# EAGLE design DQ542MA Plasma (EAGLE 9.0.0)
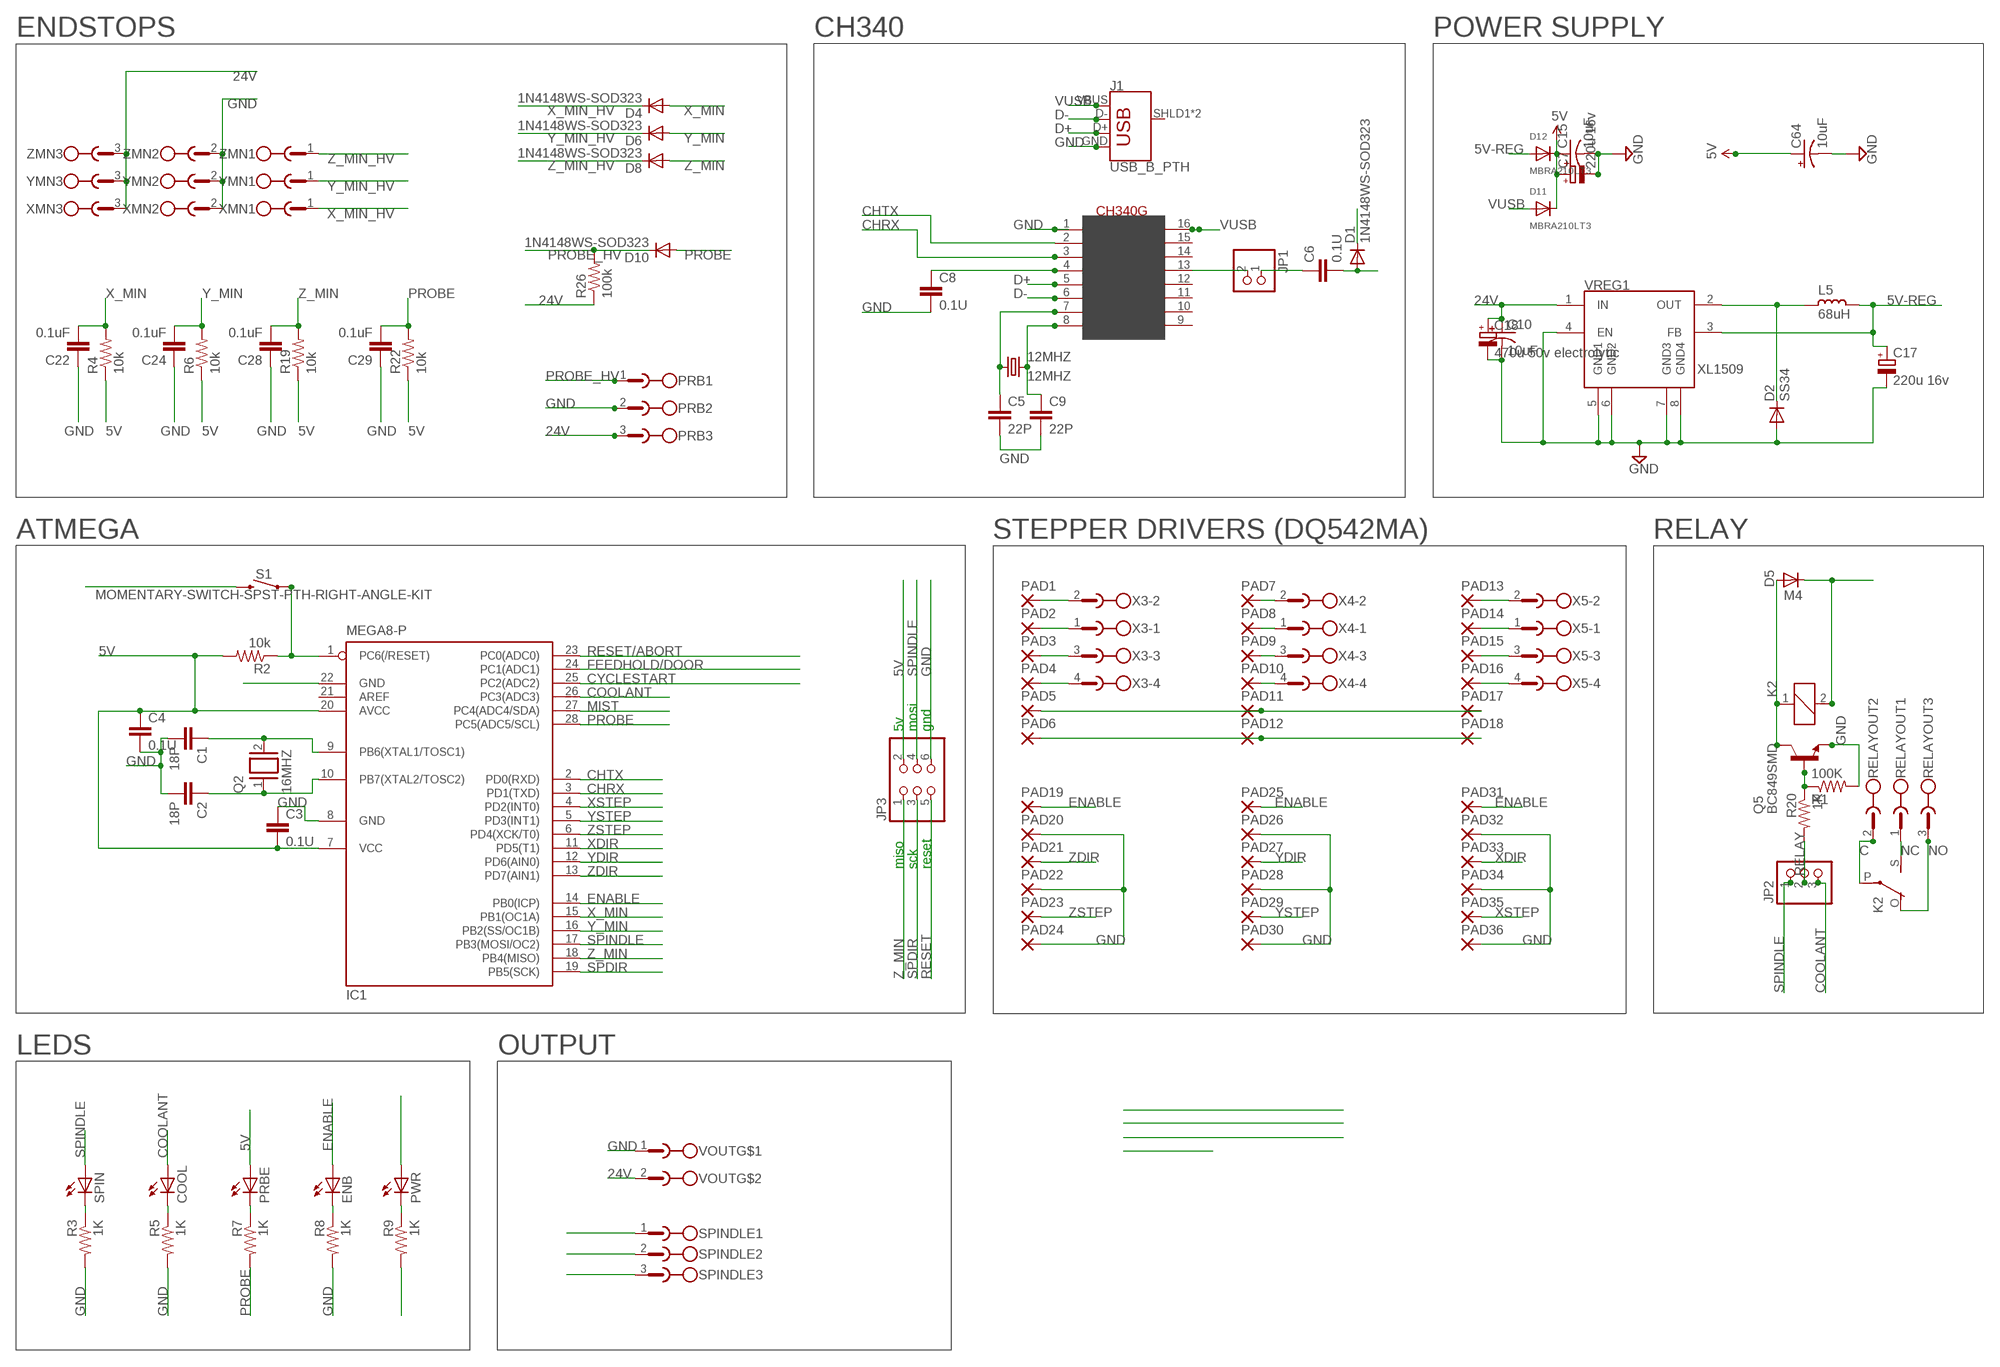
[diagram p0: schematic, sheet 1]

## Parts
12MHZ  12MHZ  CRYSTALHC49U70  [HC49U70]
C1  18P  C-EUC1206  [C1206]
C2  18P  C-EUC1206  [C1206]
C3  0.1U  C-EUC1206  [C1206]
C4  0.1U  C-EUC1206  [C1206]
C5  22P  C-EUC1206  [C1206]
C6  0.1U  C-EUC1206  [C1206]
C7  220u 16v  CPOL-EUE3.5-10  [E3,5-10]
C8  0.1U  C-EUC1206  [C1206]
C9  22P  C-EUC1206  [C1206]
C10  10uF  CAP_POL1206  [EIA3216]
C15  10uF  CAP_POL1206  [EIA3216]
C17  220u 16v  CPOL-EUE3.5-10  [E3,5-10]
C18  470u 50v electrolytic  CPOL-EUE3.5-10  [E3,5-10]
C22  0.1uF  C-EUC1206  [C1206]
C24  0.1uF  C-EUC1206  [C1206]
C28  0.1uF  C-EUC1206  [C1206]
C29  0.1uF  C-EUC1206  [C1206]
C64  10uF  CAP_POL1206  [EIA3216]
COOL  LED3MM  [LED3MM]
D1  1N4148WS-SOD323  DIODE-SOD80C  [SOD80C]
D2  SS34  DIODE-DO-214AC  [DO-214AC]
D4  1N4148WS-SOD323  DIODE-SOD80C  [SOD80C]
D5  M4  D-SOD-80  [SOD80]
D6  1N4148WS-SOD323  DIODE-SOD80C  [SOD80C]
D8  1N4148WS-SOD323  DIODE-SOD80C  [SOD80C]
D10  1N4148WS-SOD323  DIODE-SOD80C  [SOD80C]
D11  MBRA210LT3  DIODESMA  [SMADIODE]
D12  MBRA210LT3  DIODESMA  [SMADIODE]
ENB  LED3MM  [LED3MM]
IC1  MEGA8-P  [DIL28-3]
J1  USB_B_PTH  [USB-B-PTH]
JP1  PINHD-1X2  [1X02]
JP2  PINHD-1X3  [1X03]
JP3  PINHD-2X3  [2X03]
K2  G5L  [G5LE]
L5  68uH  L_CD75  [CD75]
PAD1  3,81/1,4  [3,81/1,4]
PAD2  3,81/1,4  [3,81/1,4]
PAD3  3,81/1,4  [3,81/1,4]
PAD4  3,81/1,4  [3,81/1,4]
PAD5  3,81/1,4  [3,81/1,4]
PAD6  3,81/1,4  [3,81/1,4]
PAD7  3,81/1,4  [3,81/1,4]
PAD8  3,81/1,4  [3,81/1,4]
PAD9  3,81/1,4  [3,81/1,4]
PAD10  3,81/1,4  [3,81/1,4]
PAD11  3,81/1,4  [3,81/1,4]
PAD12  3,81/1,4  [3,81/1,4]
PAD13  3,81/1,4  [3,81/1,4]
PAD14  3,81/1,4  [3,81/1,4]
PAD15  3,81/1,4  [3,81/1,4]
PAD16  3,81/1,4  [3,81/1,4]
PAD17  3,81/1,4  [3,81/1,4]
PAD18  3,81/1,4  [3,81/1,4]
PAD19  3,81/1,4  [3,81/1,4]
PAD20  3,81/1,4  [3,81/1,4]
PAD21  3,81/1,4  [3,81/1,4]
PAD22  3,81/1,4  [3,81/1,4]
PAD23  3,81/1,4  [3,81/1,4]
PAD24  3,81/1,4  [3,81/1,4]
PAD25  3,81/1,4  [3,81/1,4]
PAD26  3,81/1,4  [3,81/1,4]
PAD27  3,81/1,4  [3,81/1,4]
PAD28  3,81/1,4  [3,81/1,4]
PAD29  3,81/1,4  [3,81/1,4]
PAD30  3,81/1,4  [3,81/1,4]
PAD31  3,81/1,4  [3,81/1,4]
PAD32  3,81/1,4  [3,81/1,4]
PAD33  3,81/1,4  [3,81/1,4]
PAD34  3,81/1,4  [3,81/1,4]
PAD35  3,81/1,4  [3,81/1,4]
PAD36  3,81/1,4  [3,81/1,4]
PRB  Phoenix Pluggable 3.81mm 3 way  MC1.5/3  [MC1.5/3-G-3.81]
PRBE  LED3MM  [LED3MM]
PWR  LED3MM  [LED3MM]
Q2  16MHZ  XTAL/S  [QS]
Q5  BC849SMD  [SOT23-BEC]
R1  100K  R-US_R1206  [R1206]
R2  10k  R-US_R1206  [R1206]
R3  1K  R-US_R1206  [R1206]
R4  10k  R-US_R1206  [R1206]
R5  1K  R-US_R1206  [R1206]
R6  10k  R-US_R1206  [R1206]
R7  1K  R-US_R1206  [R1206]
R8  1K  R-US_R1206  [R1206]
R9  1K  R-US_R1206  [R1206]
R19  10k  R-US_R1206  [R1206]
R20  1K  R-US_R1206  [R1206]
R22  10k  R-US_R1206  [R1206]
R26  100k  R-US_R1206  [R1206]
RELAYOUT  Phoenix Pluggable 3.81mm 3 way  MC1.5/3  [MC1.5/3-G-3.81]
S1  MOMENTARY-SWITCH-SPST-PTH-RIGHT-ANGLE-KIT  [TACTILE_SWITCH_PTH_RIGHT_ANGLE_KIT]
SPIN  LED3MM  [LED3MM]
SPINDLE  Phoenix Pluggable 3.81mm 3 way  MC1.5/3  [MC1.5/3-G-3.81]
U$2  CH340G  [SOIC16]
VOUT  Phoenix Pluggable 3.81mm 2 way  MC1.5/2  [MC1.5/2-G-3.81]
VREG1  XL1509  [SO08]
X3  Phoenix Pluggable 3.81mm 4 way  MC1.5/4  [MC1.5/4-G-3.81]
X4  Phoenix Pluggable 3.81mm 4 way  MC1.5/4  [MC1.5/4-G-3.81]
X5  Phoenix Pluggable 3.81mm 4 way  MC1.5/4  [MC1.5/4-G-3.81]
XMN  Phoenix Pluggable 3.81mm 3 way  MC1.5/3  [MC1.5/3-G-3.81]
YMN  Phoenix Pluggable 3.81mm 3 way  MC1.5/3  [MC1.5/3-G-3.81]
ZMN  Phoenix Pluggable 3.81mm 3 way  MC1.5/3  [MC1.5/3-G-3.81]

## Nets
5V: C3.2 C4.1 C7.+ C15.A(+) C64.A(+) D1.C D5.1(C) D11.C D12.C IC1.7(VCC) IC1.20(AVCC) JP3.2 K2.2 PRBE.A PWR.A R2.2 R4.1 R6.1 R19.1 R22.1
5V-REG: C17.+ D12.A L5.1 VREG1.3(FB)
24V: C10.A(+) C18.+ PAD6.1(P) PAD12.1(P) PAD18.1(P) PRB.3 R26.1 VOUT.2 VREG1.1(IN) XMN.3 YMN.3 ZMN.3
C: K2.P(2:P) RELAYOUT.2
CHRX: IC1.3(PD1(TXD)) U$2.3(RX)
CHTX: IC1.2(PD0(RXD)) U$2.2(TX)
COIL-: D5.2(A) K2.1 Q5.C
COOLANT: COOL.A IC1.26(PC3(ADC3)) JP2.3
CYCLESTART: IC1.25(PC2(ADC2))
D+: J1.D+ U$2.5(D+)
D-: J1.D- U$2.6(D-)
DTR: JP1.2 U$2.13(DTR)
ENABLE: ENB.A IC1.14(PB0(ICP)) PAD19.1(P) PAD25.1(P) PAD31.1(P)
FEEDHOLD/DOOR: IC1.24(PC1(ADC1))
GND: C1.2 C2.2 C3.1 C4.2 C5.2 C7.- C8.2 C9.2 C10.C(-) C15.C(-) C17.- C18.- C22.1 C24.1 C28.1 C29.1 C64.C(-) D2.2(A) IC1.8(GND) IC1.22(GND) J1.GND JP3.6 PAD5.1(P) PAD11.1(P) PAD17.1(P) PAD20.1(P) PAD22.1(P) PAD24.1(P) PAD26.1(P) PAD28.1(P) PAD30.1(P) PAD32.1(P) PAD34.1(P) PAD36.1(P) PRB.2 Q5.E R1.2 R3.2 R5.2 R8.2 R9.2 S1.2 SPINDLE.1 U$2.1(GND) VOUT.1 VREG1.4(EN) VREG1.5(GND1) VREG1.6(GND2) VREG1.7(GND3) VREG1.8(GND4) XMN.2 YMN.2 ZMN.2
MIST: IC1.27(PC4(ADC4/SDA))
N$1: R3.1 SPIN.K(C)
N$2: C6.1 JP1.1
N$3: C1.1 IC1.9(PB6(XTAL1/TOSC1)) Q2.2
N$5: C2.1 IC1.10(PB7(XTAL2/TOSC2)) Q2.1
N$6: PAD10.1(P) X4.4
N$7: COOL.K(C) R5.1
N$8: PAD8.1(P) X4.1
N$9: 12MHZ.1 C5.1 U$2.7(XI)
N$10: PAD7.1(P) X4.2
N$11: 12MHZ.2 C9.1 U$2.8(XO)
N$12: PRBE.K(C) R7.1
N$13: PAD2.1(P) X3.1
N$14: PAD1.1(P) X3.2
N$15: PAD14.1(P) X5.1
N$16: PAD13.1(P) X5.2
N$17: ENB.K(C) R8.1
N$18: PWR.K(C) R9.1
N$32: PAD4.1(P) X3.4
N$35: PAD3.1(P) X3.3
N$38: PAD9.1(P) X4.3
N$40: PAD16.1(P) X5.4
N$42: Q5.B R1.1 R20.1
N$43: PAD15.1(P) X5.3
N$292: D2.1(C) L5.2 VREG1.2(OUT)
NC: K2.S(2:S) RELAYOUT.1
NO: K2.O(2:O) RELAYOUT.3
PROBE: C29.2 D10.A IC1.28(PC5(ADC5/SCL)) R7.2 R22.2
PROBE_HV: D10.C PRB.1 R26.2
RELAY: JP2.2 R20.2
RESET: C6.2 D1.A IC1.1(PC6(/RESET)) JP3.5 R2.1 S1.1
RESET/ABORT: IC1.23(PC0(ADC0))
SPDIR: IC1.19(PB5(SCK)) JP3.3 SPINDLE.3
SPINDLE: IC1.17(PB3(MOSI/OC2)) JP2.1 JP3.4 SPIN.A SPINDLE.2
V3: C8.1 U$2.4(V3)
VUSB: D11.A J1.VBUS U$2.16(VCC)
X_MIN: C22.2 D4.A IC1.15(PB1(OC1A)) R4.2
X_MIN_HV: D4.C XMN.1
XDIR: IC1.11(PD5(T1)) PAD33.1(P)
XSTEP: IC1.4(PD2(INT0)) PAD35.1(P)
Y_MIN: C24.2 D6.A IC1.16(PB2(SS/OC1B)) R6.2
Y_MIN_HV: D6.C YMN.1
YDIR: IC1.12(PD6(AIN0)) PAD27.1(P)
YSTEP: IC1.5(PD3(INT1)) PAD29.1(P)
Z_MIN: C28.2 D8.A IC1.18(PB4(MISO)) JP3.1 R19.2
Z_MIN_HV: D8.C ZMN.1
ZDIR: IC1.13(PD7(AIN1)) PAD21.1(P)
ZSTEP: IC1.6(PD4(XCK/T0)) PAD23.1(P)
Unconnected: IC1.21(AREF) J1.SHLD1(SHIELD) J1.SHLD2(SHIELD) U$2.9(CTS) U$2.10(DSR) U$2.11(RI) U$2.12(DCD) U$2.14(RTS) U$2.15(RS232)

## Notes on the sheet
- ENDSTOPS | CH340 | POWER SUPPLY
- ATMEGA | STEPPER DRIVERS (DQ542MA) | RELAY
- 5v | mosi | gnd
- miso | sck | reset
- LEDS | OUTPUT

## Library data of the parts
12MHZ = crystal:CRYSTAL: CRYSTAL; OC_FARNELL: unknown; OC_NEWARK: unknown
C1-C6 C8 C9 C22 C24 C28 C29 = rcl:C-EU: CAPACITOR, European symbol
C7 C17 C18 = rcl:CPOL-EU: POLARIZED CAPACITOR, European symbol
C10 C15 C64 = SparkFun:CAP_POL: Capacitor Polarized These are standard SMD and PTH capacitors. Normally 10uF, 47uF, and 100uF in electrolytic and tantalum varieties. Always verify the external diameter of the through hole cap, it varies with capacity, voltage, and manufacturer. The EIA devices should be standard.
COOL ENB PRBE PWR SPIN = led:LED: LED OSRAM: - CHIPLED LG R971, LG N971, LY N971, LG Q971, LY Q971, LO R971, LY R971 LH N974, LH R974 LS Q976, LO Q976, LY Q976 LO Q996 - Hyper CHIPLED LW Q18S LB Q993, LB Q99A, LB R99A - SideLED LS A670, LO A670, LY A670, LG A670, LP A670 LB A673, LV A673, LT A673, LW A673 LH A674 LY A675 LS A676, LA A676, LO A676, LY A676, LW A676 LS A679, LY A679, LG A679 - Hyper Micro SIDELED® LS Y876, LA Y876, LO Y876, LY Y876 LT Y87S - SmartLED LW L88C, LW L88S LB L89C, LB L89S, LG L890 LS L89K, LO L89K, LY L89K LS L896, LA L896, LO L896, LY L896 - TOPLED LS T670, LO T670, LY T670, LG T670, LP T670 LSG T670, LSP T670, LSY T670, LOP T670, LYG T670 LG T671, LOG T671, LSG T671 LB T673, LV T673, LT T673, LW T673 LH T674 LS T676, LA T676, LO T676, LY T676, LB T676, LH T676, LSB T676, LW T676 LB T67C, LV T67C, LT T67C, LS T67K, LO T67K, LY T67K, LW E67C LS E67B, LA E67B, LO E67B, LY E67B, LB E67C, LV E67C, LT E67C LW T67C LS T679, LY T679, LG T679 LS T770, LO T770, LY T770, LG T770, LP T770 LB T773, LV T773, LT T773, LW T773 LH T774 LS E675, LA E675, LY E675, LS T675 LS T776, LA T776, LO T776, LY T776, LB T776 LHGB T686 LT T68C, LB T68C - Hyper Mini TOPLED® LB M676 - Mini TOPLED Santana® LG M470 LS M47K, LO M47K, LY M47K Source: http://www.osram.convergy.de LUXEON: - LUMILED® LXK2-PW12-R00, LXK2-PW12-S00, LXK2-PW14-U00, LXK2-PW14-V00 LXK2-PM12-R00, LXK2-PM12-S00, LXK2-PM14-U00 LXK2-PE12-Q00, LXK2-PE12-R00, LXK2-PE12-S00, LXK2-PE14-T00, LXK2-PE14-U00 LXK2-PB12-K00, LXK2-PB12-L00, LXK2-PB12-M00, LXK2-PB14-N00, LXK2-PB14-P00, LXK2-PB14-Q00 LXK2-PR12-L00, LXK2-PR12-M00, LXK2-PR14-Q00, LXK2-PR14-R00 LXK2-PD12-Q00, LXK2-PD12-R00, LXK2-PD12-S00 LXK2-PH12-R00, LXK2-PH12-S00 LXK2-PL12-P00, LXK2-PL12-Q00, LXK2-PL12-R00 Source: www.luxeon.com KINGBRIGHT: KA-3528ASYC Source: www.kingbright.com
D1 D4 D6 D8 D10 = diode:DIODE-: DIODE
D2 = dp_devices:DIODE: Various Diode Packages
D5 = semicon-smd-ipc:D-: DIODE unfilled
D11 D12 = microbuilder:DIODE: Diode SMADIODE - SMA Surface Mount Package 20V 1A Schottky Diode Digikey (500mV @ 1A, 500uA Vr @ 20V): 641-1014-6-ND 10V 2A Schottky Diode Digikey (350mV @ 2A, 700uA Vr @ 10V): MBRA210LT3 SOD-123 30V 200mA (800mV Vf, 2uA Vr @ 25V) Schottky Diode (very fast switching for boost, etc.) - Digikey: BAT54T1GOSTR-ND 30V 500mA (430mV Vf, 130uA Vr @ 30V) Schottky Diode - Digikey: B0530W-FDICT-ND MBR120 1A 20V (0.34Vf) Schottky Diode - Digikey: MBR120VLSFT1GOSCT-ND SOD-323 10V 570mA (380mV Vf, 3ns) Schottky Diode - Digikey: ZLLS410CT-ND 1N4148WS - 75V 150mA (1V Vf @ 10mA, 4ns) Simple Diode - Digikey: 1N4148WSFSCT-ND, Mouser: 512-1N4148WS SOD-523 BAT54 30V 200mA Schottky (0.8 Vf @ 100mA, 5ns) - Digikey: BAT54XV2CT-ND 30V 30mA Schottky Diode (RB751S-40TE61) - Digikey: RB751S-40TE61CT-ND SOT23-R/W - SOT23 Package (R = Solder Paste/Reflow Ovens, W = Hand-Soldering) BAT54Film 40V 300mA - Digikey: 497-7162-1-ND DO-1N4148 Through Hole Small Current Diode (any model)
IC1 = atmel:MEGA8-P: MICROCONTROLLER 8 Kbytes FLASH, 1 kbytes SRAM, 512 bytes EEPROM, USART, 4-channel 10 bit ADC, 2-channel 8 bit ADC Pin compatible with Atmega48, ATMega88, ATMega168 Source: avr.lbr; OC_FARNELL: unknown; OC_NEWARK: unknown
J1 = SparkFun-Connectors:USB_B: USB Type B Connector SparkFun Products: SparkFun Stepoko <https://www.sparkfun.com/products/13899> PTH; PROD_ID: CONN-08278; SF_ID: PRT-00139
JP1 = pinhead:PINHD-1X2: PIN HEADER
JP2 = pinhead:PINHD-1X3: PIN HEADER
JP3 = pinhead:PINHD-2X3: PIN HEADER
K2 = relay:G5L: RELAY 1 x switch, 10 A/120 V AC, 8 A/30 V ADC, Omron; OC_FARNELL: unknown; OC_NEWARK: unknown
L5 = rc-master-smd:L_: INDUCTOR
PAD1-PAD36 = wirepad:3,81/1,4: THROUGH-HOLE PAD
PRB RELAYOUT SPINDLE XMN YMN ZMN = jt-con-phoenix-3.81:MC1.5/3: PHOENIX
Q2 = special:XTAL/S: CRYSTAL
Q5 = transistor-npn:BC849*: NPN Transistor
R1 R3 R5 R7-R9 R20 = adafruit:R-US_: RESISTOR, American symbol
R2 R4 R6 R19 R22 R26 = resistor:R-US_: RESISTOR, American symbol
S1 = SparkFun-Switches:MOMENTARY-SWITCH-SPST: Momentary Switch (Pushbutton) - SPST Normally-open (NO) SPST momentary switches (buttons, pushbuttons). Variants PTH-12MM - 12mm square, through-hole Momentary Pushbutton Switch - 12mm Square <https://www.sparkfun.com/products/9190> (COM-09190) PTH-6.0MM, PTH-6.0MM-KIT - 6.0mm square, through-hole Mini Pushbutton Switch <https://www.sparkfun.com/products/97> (COM-00097) KIT package intended for soldering kit's - only one side of pads' copper is exposed. PTH-RIGHT-ANGLE-KIT - Right-angle, through-hole Right Angle Tactile Button <https://www.sparkfun.com/products/10791> - Used on SparkFun BigTime Watch Kit <https://www.sparkfun.com/products/11734> SMD-12MM - 12mm square, surface-mount Tactile Button - SMD (12mm) <https://www.sparkfun.com/products/12993> (COM-12993) Used on SparkFun PicoBoard <https://www.sparkfun.com/products/11888> SMD-4.5MM - 4.5mm Square Trackball Switch Used on SparkFun Blackberry Trackballer Breakout <https://www.sparkfun.com/products/13169> SMD-4.6MMX2.8MM - 4.60mm x 2.80mm, surface mount Used on SparkFun SAMD21 Mini Breakout <https://www.sparkfun.com/products/13664> SMD-5.2MM, SMD-5.2-REDUNDANT - 5.2mm square, surface-mount Mini Pushbutton Switch - SMD <https://www.sparkfun.com/products/8720> (COM-08720) Used on Arduino Pro Mini <https://www.sparkfun.com/products/11114> REDUNDANT package connects both switch circuits together SMD-6.0X3.5MM - 6.0 x 3.5mm, surface mount Momentary Reset Switch SMD <https://www.sparkfun.com/products/8229> (COM-08229) SMD-6.2MM-TALL - 6.2mm square, surface mount Tactile Button - SMD (6mm) <https://www.sparkfun.com/products/12992> Used on SparkFun Digital Sandbox <https://www.sparkfun.com/products/12651> SMD-RIGHT-ANGLE - Right-angle, surface mount Used on SparkFun Block for Intel® Edison - Arduino <https://www.sparkfun.com/products/13036>; PROD_ID: CONN-10672; SF_SKU: COM-10791
U$2 = usb-serial:CH340G
VOUT = jt-con-phoenix-3.81:MC1.5/2
VREG1 = Cohesion_parts:XL1509
X3-X5 = jt-con-phoenix-3.81:MC1.5/4: PHOENIX

## Net classes
1 power: width 0.6 mm, clearance 0.305 mm
5 3.3-Amp Class: width 1.27 mm

## Board
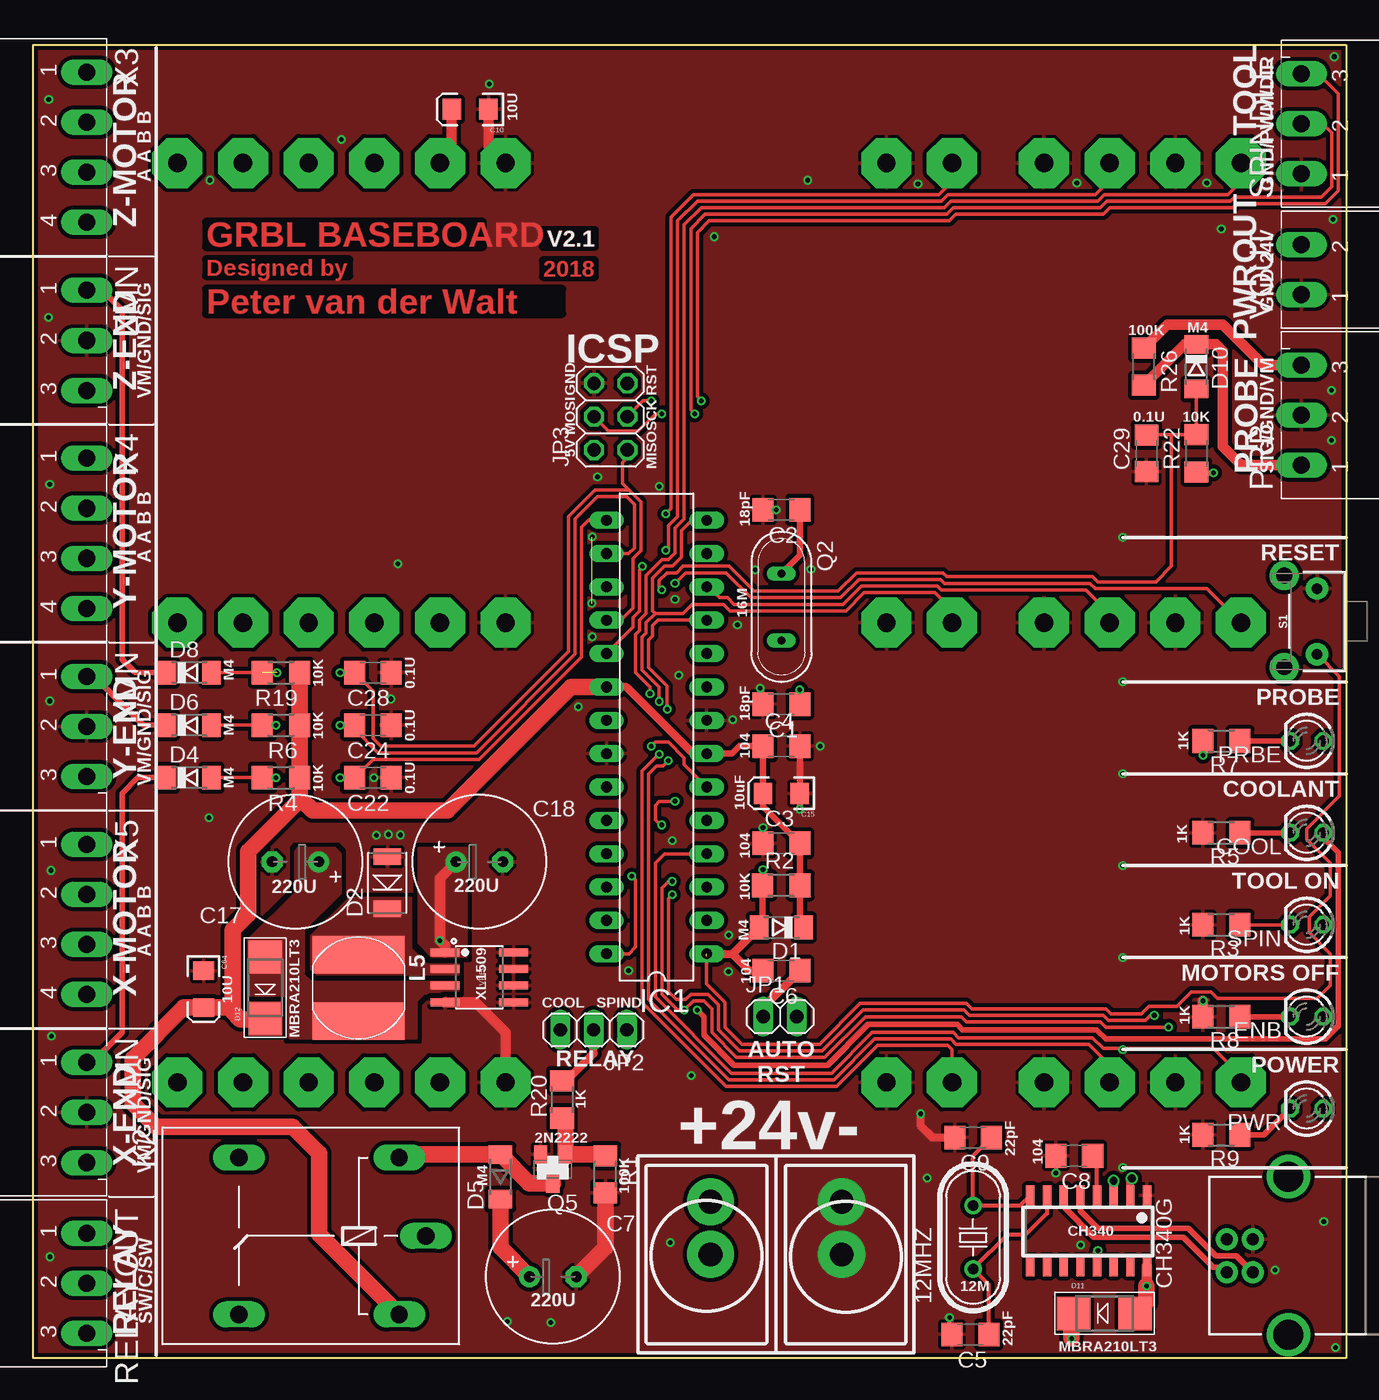
[diagram p1: board, top side]
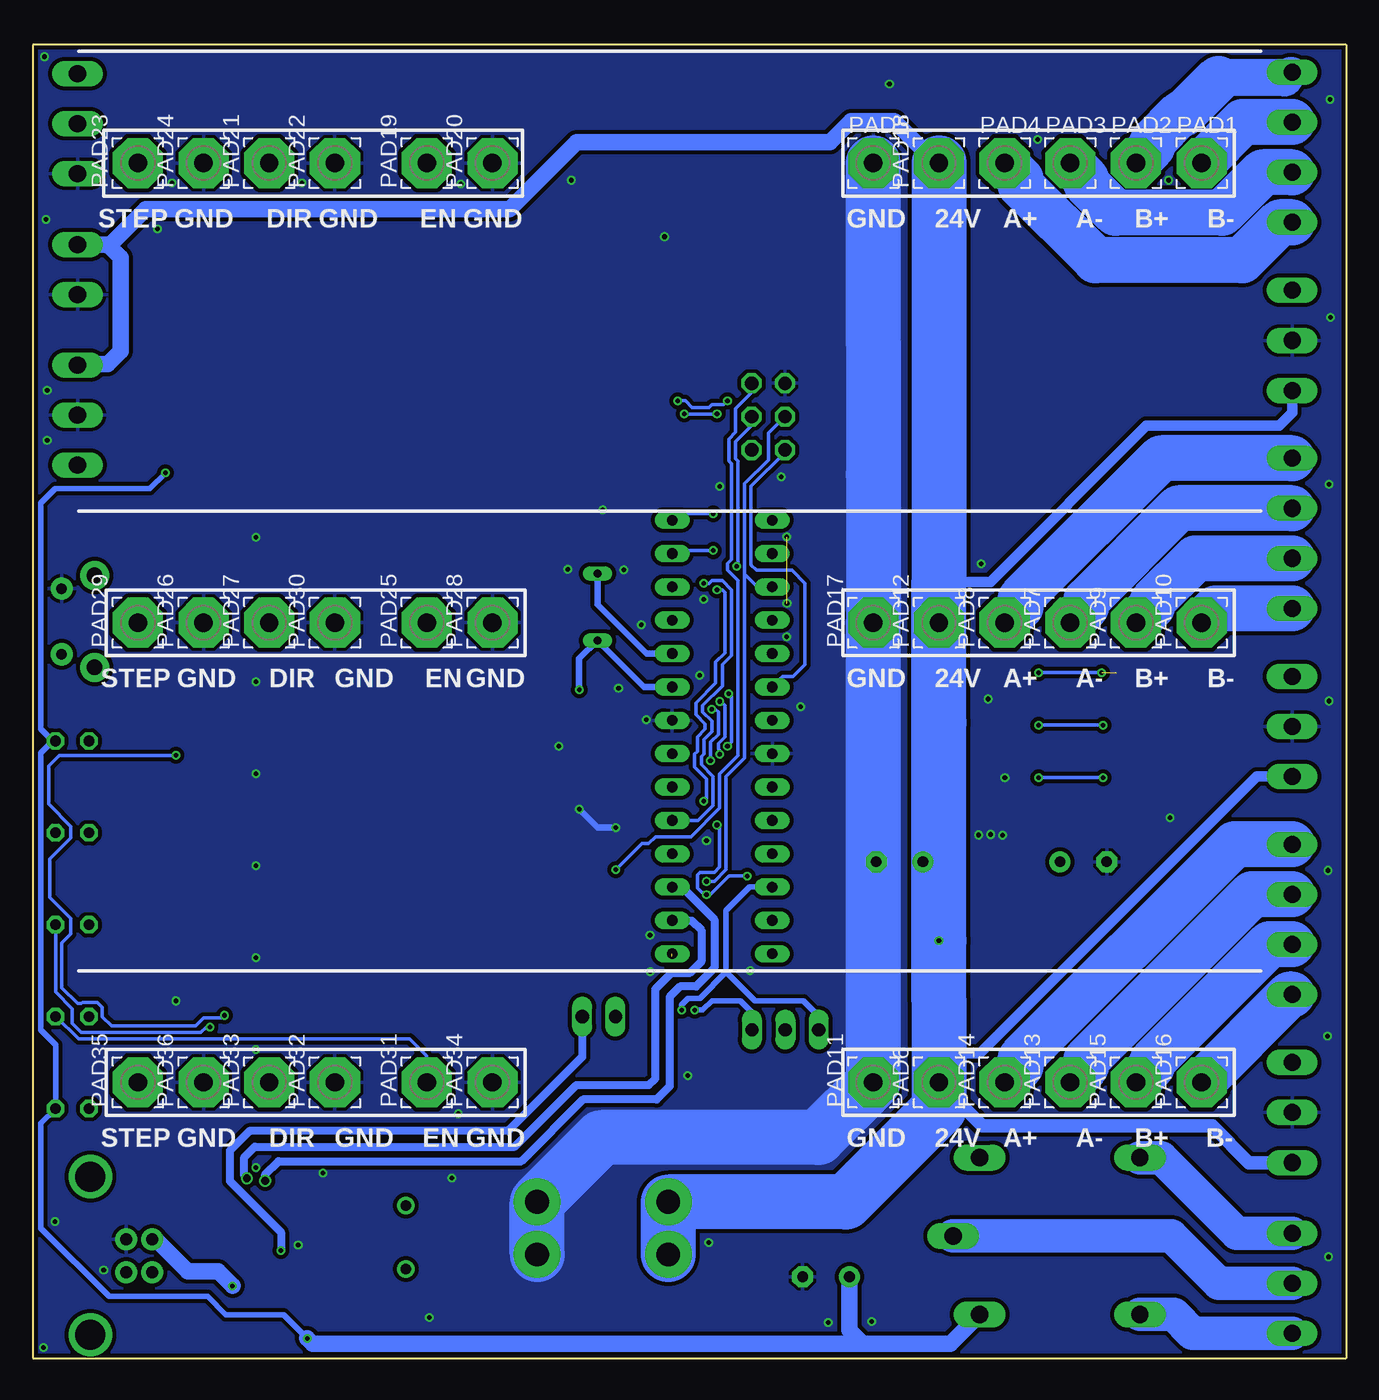
[diagram p2: board, bottom side, seen from below]

Size 100 x 100 mm. Coordinates in mm from the lower left corner, seen from the top.
Outline: 100,100 100,0 0,0 0,100 100,100
Copper layers (1*16): Top 0.035mm / dielectric 1.5mm / Bottom 0.035mm
Design rules "dirt_cheap_dirty_boards.v1": minimum track width 5mil, minimum drill 12mil, track to track 5mil, track to pad 5mil, pad to pad 5mil, via to via 5mil, smd to smd 0mil, copper to edge 10mil, drill to drill 10mil, minimum pad ring 10mil, minimum via ring 6mil, stop-mask expansion 2mil, vias tented up to drill 25mil, thermal gap 10mil

### Footprints (pad centres in the part's own frame; a part is rotated, then mirrored left to right if it is on the bottom)
HC49U70 = drill 0.813: 1 -2.413,0; 2 2.413,0
C1206 = smd 1.6 x 1.8: 1 -1.4,0; 2 1.4,0
E3,5-10 = drill 0.813 pad 1.6: + -1.778,0 | drill 0.813 pad 1.6 octagon: - 1.778,0
EIA3216 = smd 1.4 x 1.6: A 1.4,0; C -1.4,0
LED3MM = drill 0.813 octagon: A -1.27,0; K 1.27,0
SOD80C = smd 1.4 x 1.8: A 1.7,0; C -1.7,0
DO-214AC = smd 1.27 x 2.1: 1 -1.98,0; 2 1.98,0
SOD80 = smd 1.4 x 1.8: 1 -1.7,0; 2 1.7,0
SMADIODE = smd 2.54 x 2.54: A 2.349,0; C -2.349,0
DIL28-3 = drill 0.813 long: 1 -16.51,-3.81; 2 -13.97,-3.81; 3 -11.43,-3.81; 4 -8.89,-3.81; 5 -6.35,-3.81; 6 -3.81,-3.81; 7 -1.27,-3.81; 8 1.27,-3.81; 9 3.81,-3.81; 10 6.35,-3.81; 11 8.89,-3.81; 12 11.43,-3.81; 13 13.97,-3.81; 14 16.51,-3.81; 15 16.51,3.81; 16 13.97,3.81; 17 11.43,3.81; 18 8.89,3.81; 19 6.35,3.81; 20 3.81,3.81; 21 1.27,3.81; 22 -1.27,3.81; 23 -3.81,3.81; 24 -6.35,3.81; 25 -8.89,3.81; 26 -11.43,3.81; 27 -13.97,3.81; 28 -16.51,3.81
USB-B-PTH = drill 0.914 pad 1.676: D+ 4,1.25; D- 5.981,1.25; GND 4,-1.25; VBUS 5.981,-1.25 | drill 2.286: SHLD1 1.282,-6.02; SHLD2 1.282,6.02
1X02 = drill 1.016 long: 1 -1.27,0; 2 1.27,0
1X03 = drill 1.016 long: 1 -2.54,0; 2 0,0; 3 2.54,0
2X03 = drill 1.016 octagon: 1 -2.54,-1.27; 2 -2.54,1.27; 3 0,-1.27; 4 0,1.27; 5 2.54,-1.27; 6 2.54,1.27
G5LE = drill 1.321 long: 1 -7.493,-5.969; 2 -7.493,5.969; O 4.699,5.969; P -9.525,0; S 4.699,-5.969
CD75 = smd 7 x 2.85: 1 0,2.54; 2 0,-2.54
3,81/1,4 = drill 1.397 pad 3.81 octagon: 1 0,0
MC1.5/3-G-3.81 = drill 1.3 long: 1 -3.81,8; 2 0,8; 3 3.81,8
QS = drill 0.61 long: 1 -2.54,0; 2 2.54,0
SOT23-BEC = smd 1 x 1.4: B -0.95,-1.1; C 0,1.1; E 0.95,-1.1
R1206 = smd 1.6 x 1.803: 1 -1.422,0; 2 1.422,0
TACTILE_SWITCH_PTH_RIGHT_ANGLE_KIT = drill 0.8 pad 1.7: 1 -2.5,0; 2 2.5,0 | drill 1.2 pad 2.2: ANCHOR1 -3.5,2.5; ANCHOR2 3.5,2.5
SOIC16 = smd 0.635 x 1.524: 1 -4.445,-2.695; 2 -3.175,-2.695; 3 -1.905,-2.695; 4 -0.635,-2.695; 5 0.635,-2.695; 6 1.905,-2.695; 7 3.175,-2.695; 8 4.445,-2.695; 9 4.445,2.695; 10 3.175,2.695; 11 1.905,2.695; 12 0.635,2.695; 13 -0.635,2.695; 14 -1.905,2.695; 15 -3.175,2.695; 16 -4.445,2.695
MC1.5/2-G-3.81 = drill 1.3 long: 1 -3.81,8; 2 0,8
SO08 = smd 0.61 x 2.21: 1 -1.905,-2.616; 2 -0.635,-2.616; 3 0.635,-2.616; 4 1.905,-2.616; 5 1.905,2.616; 6 0.635,2.616; 7 -0.635,2.616; 8 -1.905,2.616
MC1.5/4-G-3.81 = drill 1.3 long: 1 -9.525,8; 2 -5.715,8; 3 -1.905,8; 4 1.905,8

### Placement (x,y rotation side)
12MHZ  71.6,9.2 90 top
C1  57,49.8 180 top
C2  57,64.6 180 top
C3  57,39.2 0 top
C4  57,46.6 0 top
C5  71.4,1.8 180 top
C6  57,29.5 180 top
C7  39.6,6.2 0 top
C8  79.3,15.4 180 top
C9  71.6,16.8 180 top
C10  33.3,95.1 180 top
C15  57,43 180 top
C17  20,37.8 180 top
C18  34,37.8 0 top
C22  25.9,44.2 180 top
C24  25.9,48.2 180 top
C28  25.9,52.2 180 top
C29  84.8,68.9 90 top
C64  13,28.1 270 top
COOL  97,40 180 top
D1  57,32.8 180 top
D2  27,36.2 90 top
D4  11.9,44.2 0 top
D5  35.6,13.8 90 top
D6  11.9,48.2 0 top
D8  11.9,52.2 0 top
D10  88.6,75.5 270 top
D11  81.6,3.4 0 top
D12  17.7,28.2 90 top
ENB  97,26 180 top
IC1  47.5,47.3 90 top
J1  96.9,7.8 180 top
JP1  56.9,26 0 top
JP2  42.7,25 180 top
JP3  44,71.7 90 top
K2  20.4,9.3 180 top
L5  24.8,28.2 180 top
PAD1  11,91 0 bottom
PAD2  16,91 0 bottom
PAD3  21,91 0 bottom
PAD4  26,91 0 bottom
PAD5  36,91 0 bottom
PAD6  31,21 90 bottom
PAD7  21,56 90 bottom
PAD8  26,56 90 bottom
PAD9  16,56 90 bottom
PAD10  11,56 90 bottom
PAD11  36,21 90 bottom
PAD12  31,56 90 bottom
PAD13  21,21 90 bottom
PAD14  26,21 90 bottom
PAD15  16,21 90 bottom
PAD16  11,21 90 bottom
PAD17  36,56 90 bottom
PAD18  31,91 90 bottom
PAD19  70,91 90 bottom
PAD20  65,91 90 bottom
PAD21  82,91 90 bottom
PAD22  77,91 90 bottom
PAD23  92,91 90 bottom
PAD24  87,91 90 bottom
PAD25  70,56 90 bottom
PAD26  87,56 90 bottom
PAD27  82,56 90 bottom
PAD28  65,56 90 bottom
PAD29  92,56 90 bottom
PAD30  77,56 90 bottom
PAD31  70,21 90 bottom
PAD32  77,21 90 bottom
PAD33  82,21 90 bottom
PAD34  65,21 90 bottom
PAD35  92,21 90 bottom
PAD36  87,21 90 bottom
PRB  104.6,71.8 90 top
PRBE  97,47 180 top
PWR  97,19 180 top
Q2  57,57.2 270 top
Q5  39.6,14.4 180 top
R1  43.6,14 270 top
R2  57,36 0 top
R3  90.5,33 180 top
R4  18.9,44.2 180 top
R5  90.5,40 180 top
R6  18.9,48.2 180 top
R7  90.5,47 180 top
R8  90.5,26 180 top
R9  90.5,17 180 top
R19  18.9,52.2 180 top
R20  40.3,19.7 90 top
R22  88.6,68.9 90 top
R26  84.6,75.5 270 top
RELAYOUT  -3.9,5.7 270 top
S1  97.8,56.1 90 top
SPIN  97,33 180 top
SPINDLE  104.6,94 90 top
U$2  80.4,9.7 180 top
VOUT  104.6,84.8 90 top
VREG1  34,29 270 top
X3  -3.9,88.4 270 top
X4  -3.9,59 270 top
X5  -3.9,29.6 270 top
XMN  -3.9,18.7 270 top
YMN  -3.9,48.1 270 top
ZMN  -3.9,77.5 270 top

### Tracks (layer width: path | path; a pad name or v marks a point on that pad's centre or on a via)
5V  (via drill 0.35, 0.35 pad 0.41)
  Top 0.406: v89.9,67.4 88.68,67.4 R22.1
  Top 0.508: D1.C 58.42,33.08 R2.2 58.4,36.02 C3.2 55.6,42 C15.A 55.6,46.4 | 55.6,46.4 C4.1 | IC1.7 53.23,46.03 53.8,46.6 55.4,46.6 55.6,46.4
  Top 0.61: IC1.7 50.27,46.03 45.2,51.1 IC1.20
  Top 0.813: 17.65,25.8 D12.C
  Top 1.27: R19.1 R6.1 R4.1 20.32,42.52 | 20.32,42.52 16.4,38.6 16.4,33.8 15.2,32.6 15.2,26.4 | 15.2,26.4 15.8,25.8 17.65,25.8 | 15.2,26.4 14.9,26.7 C64.A 11.5,26.7 7.6,22.8 7.6,19.4 9.4,17.6 19.8,17.6 21.8,15.6 21.8,9.42 K2.2 | D11.C 79.1,3.25 v79.1,1.5 | D5.1 35.6,8.42 C7.+ | 20.32,42.52 20.48,42.52 21.3,41.7 31.6,41.7 41,51.1 IC1.20
  Bottom 0.254: JP3.2 42.73,68.97 45.3,66.4 45.3,60.4 44.9,60 42.2,60 41.2,59 41.2,52.8 42.1,51.9 42.9,51.9 IC1.20
  Bottom 0.406: 98.5,47 99.4,46.1 99.4,25 98.27,23.87 PWR.A 99.4,17.87 99.4,9.9 94.2,4.7 86.7,4.7 85.3,3.3 80.9,3.3 v79.1,1.5 | PRBE.A 98.5,47 | 98.5,47 99.4,47.9 99.4,65.1 98.3,66.2 91.1,66.2 v89.9,67.4
  Bottom 1.27: v79.1,1.5 78.7,1.1 36.8,1.1 | K2.2 30.12,1.1 36.8,1.1 | C7.+ 37.82,2.12 36.8,1.1
5V-REG
  pour Top (isolate 0.406, no thermals): 32.4,28.6 21.2,28.6 20.6,29.2 20.6,32.6 23.4,35.4 23.4,38.4 23,38.8 20.2,38.8 20,38.6 20,35.4 16.4,31.8 16.4,27.6 16.6,27.4 19.2,27.4 19.4,27.2 19.4,24.6 19.6,24.4 29.2,24.4 29.2,27.2 29.8,27.8 32.4,27.8
24V  (via drill 0.35, 1.8 pad 3.6)
  Top 0.813: VREG1.1 31.38,31.42 v31,31.8 31,36.58 C18.+ | C10.A 31.9,91.9 PAD18.1 | PRB.3 93.69,75.61 90.6,78.7 86.38,78.7 R26.1
  Bottom 0.254: 31.12,65.8 31,65.8 | 31.22,48.4 31,48.4
  Bottom 0.813: ZMN.3 4.1,72 5.1,71 15.2,71 27.1,59.1 30.85,59.1 31,59.25 | 30.97,27.1 31,27.13 | YMN.3 6.81,44.29 27.9,23.2 31,23.2
  Bottom 1.016: 31.72,21.72 PAD6.1 27.7,17.7 10.2,17.7 7.39,14.89 XMN.3
  Bottom 1.27: 31,90.7 31,90.8 34.4,94.2 37.7,94.2 39.3,92.6 58.6,92.6 63.7,87.5 91.4,87.5 94.1,84.8 | VOUT.2 94.1,84.8 | 94.1,84.8 94.1,84.6 93.3,83.8 93.3,76.7 94.3,75.7 96.51,75.7 PRB.3
  Bottom 4.2: PAD18.1 31,90.7 31,65.8 31,59.25 PAD12.1 31,48.4 v31,31.8 31,27.13 31,23.2 PAD6.1 31,19 38.1,11.9 v51.6,11.9 v51.6,7.9
  pour Top (isolate 0.406, no thermals): 32.4,30.6 30.4,30.6 29.4,31.6 29.4,38.8 33,38.8 33,30.6
C
  Bottom 2.54: K2.P 13.3,9.3 9.7,5.7 RELAYOUT.2
CHRX  (via drill 0.6 pad 0.3)
  Top 0.61: U$2.3 v82.31,13.49 v82.3,13.5
  Bottom 0.61: IC1.3 50.57,35.87 48.1,33.4 48.1,29.7 49.5,28.3 50.7,28.3 51.5,27.5 51.5,20.7 52.5,19.7 58.1,19.7 62.8,15 81.3,15 82.3,14 v82.3,13.5
CHTX  (via drill 0.6 pad 0.3)
  Top 0.61: U$2.2 83.58,13.47 v83.7,13.7
  Bottom 0.61: IC1.2 49.83,33.33 49.1,32.6 49.1,30.2 50,29.3 51.4,29.3 52.6,28.1 52.6,21.3 53.1,20.8 58.6,20.8 63.3,16.1 83.1,16.1 83.9,15.3 83.9,13.9 v83.7,13.7
COIL-
  Top 1.27: K2.1 28.12,15.5 D5.2 37.8,13.3 Q5.C
COOLANT  (via drill 0.35 pad 0.41)
  Top 0.406: COOL.A 98.27,39.63 99.4,38.5 99.4,25.3 98.4,24.3 81.7,24.3 81,25 70.8,25 70.4,25.4 63.6,25.4 60.5,22.3 53.4,22.3 51.1,24.6 51.1,26 v50.6,26.5
  Bottom 0.406: v50.6,26.5 50.6,26.9 50.1,27.4 49.2,27.4 47.2,29.4 | IC1.26 45.43,35.87 47.2,34.1 47.2,29.4 | JP2.3 40.16,26.06 41.3,27.2 45,27.2 47.2,29.4
D+
  Top 0.406: U$2.5 79.77,11.23 81.1,9.9 88,9.9 90.1,7.8 91.65,7.8 J1.D+
D-
  Top 0.406: U$2.6 78.5,11.51 80.8,9.2 87.6,9.2 89.9,6.9 90.57,6.9 J1.D-
DTR  (via drill 0.35)
  Top 0.61: U$2.13 81.03,8.13 v81.1,8.2
  Bottom 0.61: JP1.2 58.17,22.93 63.8,17.3 83.5,17.3 85,15.8 85,13.5 81.1,9.6 v81.1,8.2
ENABLE  (via drill 0.35 pad 0.3)
  Top 0.254: PAD19.1 70,89.6 69,88.6 50.3,88.6 48.6,86.9 48.6,64.7 v48.2,64.3 | PAD31.1 70,23.5 69.7,23.8 64.3,23.8 61.2,20.7 52.8,20.7 46.4,27.1 46.4,44.7 v47.7,46 | IC1.14 50.2,63.8 49.4,63 49.4,61 48.7,60.3 48.1,60.3 47.2,59.4 47.2,56.9 47.4,56.7 | PAD25.1 70,57 68.7,58.3 63.3,58.3 61.9,56.9 53.1,56.9 52.6,57.4 50.2,57.4 49.5,56.7 47.4,56.7 | v47.7,50 47.7,51.1 46.4,52.4 46.4,54.9 46.7,55.2 46.7,56 47.4,56.7
  Bottom 0.254: v48.2,64.3 50.82,64.3 IC1.14 | v47.7,50 47.6,50 47.3,49.7 47.3,47.3 47.8,46.8 47.8,46.4 47.7,46.3 v47.7,46 | ENB.A 98.2,26 96.5,24.3 71.3,24.3 70,23 PAD31.1
GND  (via drill 0.35, 1.8 pad 3.6)  (1 unrouted)
  Top 0.305: C8.2 v77.9,14.1 | C5.2 69.8,2 v69.8,3.1
  Top 0.508: C2.2 v56.6,64.6 | C1.2 55.4,50 v55.4,51 | C4.2 C15.C v58.4,41.8 | C3.1 v55.6,40.4
  Top 0.61: v67.6,18.6 67.6,17.7 68.5,16.8 C9.2
  Top 0.813: VREG1.4 33.7,27.09 36,24.8 PAD11.1 | C10.C 34.7,92.3 PAD5.1 | R8.2 89.08,27.18 v89.1,27.2
  Top 1.27: R1.2 43.6,8.42 C7.-
  Bottom 0.254: 36,67.12 36,67.3
  Bottom 0.508: v55.6,40.4 57,40.4 v58.4,41.8
  Bottom 4: 35.88,77.2 36,77.32
  Bottom 4.2: PAD5.1 36,77.32 36,67.3 PAD17.1 PAD11.1 40.2,16.8 56.7,16.8 v61.6,11.9 v61.6,7.9
  other vias: 99.2,0.8 42.59,62.54 42.57,57.47 42.59,54.94 41.53,49.6 59.25,60.07 55,60.04 53.66,55.85 52.97,29.43 45.36,29.51 27.07,39.88 26.15,39.83 27.98,39.84 13.4,41.15 27.25,50.19 25.98,44.2 53.3,48.62 59.96,46.59 34.77,97.03 1.21,95.85 1.19,79.25 1.29,66.55 1.29,50.04 1.38,37.14 1.41,24.51 1.32,7.72 47.7,66.4 48.9,57.8 83,62.5 83,51.5 83,44.5 83,37.5 83,30.5 83,23.5 83,14.5 50.13,21.5 48.53,8.8 39.43,2.7 36.13,2.8 98.3,10.4 94.6,6.7 98.9,69.9 98.9,73.7 99,86.7 89.4,89.5 79.5,89.5 67.4,89.4 59,89.7 13.5,89.7 27.8,60.5 99.1,99.1 23.5,92.8 43,67.1 49.2,52 48.7,39.4 53,32.2 68.1,13.7 79.8,8.6 90.5,86 51.9,85.4
  pour Top (isolate 0.305, rank 6): 0,0 100,0 100,100 0,100
  pour Bottom (isolate 0.305, rank 6): 0,0 100,0 100,100 0,100
N$1
  Top 0.254: R3.1 SPIN.K
N$2
  Top 0.61: JP1.1 55.63,26.73 C6.1
N$3  (via drill 0.35 pad 0.3)
  Top 0.508: v58.4,50.9 C1.1
  Bottom 0.508: IC1.9 53.45,51.11 Q2.2 58.4,53.26 v58.4,50.9
N$5
  Top 0.508: C2.1 58.4,61.14 Q2.1
  Bottom 0.508: IC1.10 53.25,53.65 57,57.4 Q2.1
N$6
  Bottom 3.5: X4.4 9.9,57.09 PAD10.1
N$7
  Top 0.406: R5.1 COOL.K
N$8
  Bottom 3.5: PAD8.1 24.78,57.22 24.78,57.83 14.08,68.53 X4.1
N$9
  Top 0.305: U$2.7 77.22,11.03 75.6,9.4 74.21,9.4 12MHZ.1 72.8,5.59 C5.1
N$10
  Bottom 3.5: PAD7.1 19.78,57.22 19.78,57.7 12.76,64.72 X4.2
N$11
  Top 0.305: U$2.8 75.17,11.61 12MHZ.2 71.6,15.4 C9.1
N$12
  Top 0.406: R7.1 PRBE.K
N$13
  Bottom 2.3: X3.1 4.28,97.92 4.7,97.5
  Bottom 2.8: 4.7,97.5 9.63,97.5 9.71,97.42
  Bottom 3.5: 9.71,97.42 12.35,94.78 12.57,94.78 14.78,92.57 14.78,92.22 PAD2.1
N$14
  Bottom 3.5: X3.2 7.88,94.11 PAD1.1
N$15
  Bottom 3.5: PAD14.1 24.78,22.22 24.78,22.82 8.48,39.12 X5.1
N$16
  Bottom 3.5: PAD13.1 19.78,22.22 19.78,22.7 7.16,35.31 X5.2
N$17
  Top 0.406: R8.1 ENB.K
N$18
  Top 0.406: R9.1 93.73,17 PWR.K
N$32
  Bottom 3.5: X3.4 5.03,86.5 7.93,83.59 19.07,83.59 24.78,89.3 24.78,89.78 PAD4.1
N$35
  Bottom 3.5: PAD3.1 19.78,89.78 19.78,89.43 17.57,87.22 9.43,87.22 6.35,90.31 X3.3
N$38
  Bottom 3.5: PAD9.1 14.78,57.22 14.78,57.57 11.44,60.91 X4.3
N$40
  Bottom 3.5: X5.4 4.3,27.7 PAD16.1
N$42
  Top 1.27: R1.1 43.52,15.5 Q5.B 40.55,18.03 R20.1
N$43
  Bottom 3.5: PAD15.1 14.78,22.22 14.78,22.57 5.84,31.5 X5.3
N$292
  pour Top (isolate 0.406, rank 2, no thermals): 32.4,29.2 21.4,29.2 21.2,29.4 21.2,32.4 23.8,35 28.8,35 28.8,31.4 30.2,30 32.4,30
NC
  Bottom 2.54: K2.S 14.07,15.27 8.3,9.5 RELAYOUT.1
NO
  Bottom 2.54: RELAYOUT.3 11.69,1.89 13.13,3.33 K2.O
PROBE  (via drill 0.35 pad 0.41)
  Top 0.254: 88.62,70.3 R22.2 | 86.72,70.32 84.82,70.32 C29.2 | R22.2 D10.A | R22.2 86.72,70.32 | 86.72,70.32 86.7,70.3 86.7,60.3 85.5,59.1 81.1,59.1 80.7,59.5 69.6,59.5 69.3,59.8 62.7,59.8 61.3,58.4 54.9,58.4 53,60.3 49.5,60.3 49,59.8 48.3,59.8 47.7,59.2 47.7,58.7 v47.9,58.5 | IC1.28 45.4,30.8 45.9,31.3 45.9,36.4 v45.6,36.7 | R7.2 89.08,45.92 v89.1,45.9 | v85.4,26.1 85.1,26.1 84.7,25.7 81.9,25.7 81.5,26.1 71.3,26.1 70.9,26.5 63.2,26.5 60.1,23.4 53.8,23.4 52.2,25 52.2,26.9 51.4,27.7 50.1,27.7 49.7,27.3 49,27.3 48.4,27.9 48.4,35 v48.7,35.3 | v47.9,40.6 47.8,40.6 47.4,41 47.4,42.1 47.7,42.4 v48.9,42.4
  Bottom 0.254: v47.9,58.5 47.5,58.5 47.3,58.3 47.3,53.7 48,53 48,51.4 49.5,49.9 49.5,49 48.8,48.3 48.8,47.9 49.4,47.3 49.4,46.2 49.6,46 49.6,45 48.7,44.1 48.7,42.6 v48.9,42.4 | v89.1,45.9 98,45.9 98.8,45.1 98.8,42.2 97.1,40.5 97.1,39.6 98.7,38 98.7,35.1 97.1,33.5 97.1,32.3 97.8,31.6 97.8,28.2 96.6,27 96.3,27 96.2,27.1 95.1,27.1 94.7,26.7 94.7,26 94,25.3 87.6,25.3 87,25.9 85.6,25.9 v85.4,26.1 | v45.6,36.7 47,36.7 48.4,35.3 v48.7,35.3 48.9,35.3 49.4,35.8 49.4,36.8 49.2,37 48.1,37 47.7,37.4 47.7,40.4 v47.9,40.6
PROBE_HV
  Top 0.813: PRB.1 92.01,67.99 90.6,69.4 90.6,76.7 90.1,77.2 D10.C 87.72,77.2 R26.2
RELAY
  Top 0.254: 40.4,21.22 R20.2
  Top 0.61: 40.4,21.22 40.72,21.22 42.7,23.2 JP2.2
RESET  (via drill 0.35 pad 0.41)  (1 unrouted)
  Top 0.254: v55.6,37.2 55.6,36.02 R2.1 | 51.31,30.59 51.31,28.49 52.7,27.1 52.7,25.2 54,23.9 59.9,23.9 63,27 71.1,27 71.5,26.6 81.7,26.6 82.1,26.2 84.4,26.2 85,26.8 87.1,26.8 88.2,27.9 89.7,27.9 90.2,27.4 97.8,27.4 98.8,28.4 98.8,30.8 97.2,32.4 97.2,33.6 98.8,35.2 98.8,37.7 97,39.5 97,40.3 99.5,42.8 99.5,51.9 S1.1
  Top 0.508: R2.1 55.58,33.08 D1.A
  Top 0.61: 55.3,32.7 D1.A 53.29,30.79 | IC1.1 53.29,30.79 | C6.2 54.58,29.5 53.29,30.79
  Bottom 0.254: JP3.5 45.27,73.53 46.5,72.3 46.5,70.5 47,70 47,68.3 46.8,68.1 46.8,60.8 47.1,60.5 47.1,60 46.3,59.2 46.3,45.9 47.7,44.5 47.7,41.9 49.9,39.7 52.6,39.7 53.1,39.2 53.6,39.2 v55.6,37.2
SPDIR  (via drill 0.35 pad 0.41)
  Top 0.254: IC1.19 45.7,55.66 45.7,56.4 46.2,56.9 46.2,60 46.4,60.2 v46.4,60.3 | v50.9,72.9 50.6,73.2 50.6,85.7 51.5,86.6 69.8,86.6 70.3,87.1 81.5,87.1 82,87.6 91.4,87.6 91.7,87.9 98.4,87.9 99.4,88.9 99.4,96.3 97.9,97.8 SPINDLE.3 | v47.1,72.9 46.47,72.9 JP3.3
  Bottom 0.254: JP3.3 45.27,71.03 46.5,69.8 46.5,68.5 46.3,68.3 46.3,60.4 v46.4,60.3 | v50.9,72.9 50.3,72.9 49.8,72.4 48.5,72.4 48.3,72.6 47.4,72.6 v47.1,72.9
SPINDLE  (via drill 0.35 pad 0.41)
  Top 0.254: v50.4,71.9 50.1,72.2 50.1,86 51.2,87.1 69.6,87.1 70.1,87.6 81.3,87.6 81.8,88.1 91.2,88.1 91.5,88.4 98.1,88.4 98.9,89.2 98.9,93.3 98.2,94 SPINDLE.2 | v47.9,71.9 47.4,71.9 46.1,70.6 43.83,70.6 JP3.4 | v86.5,25.2 81.7,25.2 81.3,25.6 71.1,25.6 70.7,26 63.4,26 60.3,22.9 53.6,22.9 51.7,24.8 51.7,26.6 51.1,27.2 50.3,27.2 v49.6,26.5 49.1,26.5 47.9,27.7 47.9,35.8 48.4,36.3 v48.7,36.3
  Bottom 0.254: IC1.17 44.83,58.73 45.8,59.7 | 45.8,59.7 45.8,66.6 44,68.4 44,70.43 JP3.4 | v50.4,71.9 v47.9,71.9 | 45.8,59.7 45.8,45.7 47.2,44.3 47.2,37.2 48.1,36.3 v48.7,36.3 | SPIN.A 98.27,27.87 97,26.6 97,25.5 96.3,24.8 87.2,24.8 86.8,25.2 v86.5,25.2
  Bottom 0.406: v49.6,26.5 49,26.5 48.3,27.2 46.1,27.2 45.3,26.4 45.3,25.06 JP2.1
V3
  Top 0.305: U$2.4 81.03,14.56 80.7,14.9 C8.1
VUSB  (via drill 0.35)
  Top 0.813: U$2.16 84.84,5.54 v84.8,5.5
  Top 1.27: v84.8,5.5 84.8,4.25 D11.A
  Bottom 1.27: J1.VBUS 90.65,9.05 88.2,6.6 85.9,6.6 v84.8,5.5
X_MIN  (via drill 0.35)
  Top 0.254: v23.4,44.2 C22.2 25.9,45.6 34,45.6 41.8,53.4 41.8,63.3 42.31,63.81 IC1.15 | D4.A R4.2 v18.5,44.2
  Bottom 0.254: v23.4,44.2 v18.5,44.2
X_MIN_HV
  Top 0.406: XMN.1 4.51,22.51 6.8,24.8 6.8,43 8,44.2 D4.C
XDIR  (via drill 0.35 pad 0.3)
  Top 0.254: PAD33.1 82,22.3 80.4,23.9 70.3,23.9 69.9,24.3 64.1,24.3 61,21.2 53,21.2 46.9,27.3 46.9,44.5 47.5,45.1 48,45.1 v48.4,45.5 | v48.3,49.4 48.3,51.2 46.9,52.6 46.9,54.7 47.2,55 47.2,55.8 47.6,56.2 IC1.11
  Bottom 0.254: v48.3,49.4 48,49.4 47.8,49.2 47.8,47.5 48.4,46.9 v48.4,45.5
XSTEP
  Top 0.254: PAD35.1 92,21.5 89.9,23.6 81.5,23.6 80.7,24.4 70.5,24.4 70.1,24.8 63.9,24.8 60.8,21.7 53.2,21.7 47.4,27.5 47.4,37.7 48.1,38.4 IC1.4
Y_MIN  (via drill 0.35)
  Top 0.254: v23.4,48.2 C24.2 24.5,47.9 26.3,46.1 33.8,46.1 41.3,53.6 41.3,63.9 43,65.6 45.2,65.6 45.8,65 45.8,61.7 45.37,61.27 IC1.16 | D6.A R6.2 v18.5,48.2
  Bottom 0.254: v23.4,48.2 v18.5,48.2
Y_MIN_HV
  Top 0.406: D6.C 8.4,48.2 4.69,51.91 YMN.1
YDIR
  Top 0.254: PAD27.1 82,56.7 80.2,58.5 69.2,58.5 68.9,58.8 63.1,58.8 61.7,57.4 53.4,57.4 52.9,57.9 52.3,57.9 51.8,58.4 51.64,58.4 IC1.12
YSTEP  (via drill 0.35 pad 0.3)
  Top 0.254: PAD29.1 89.4,58.6 80.9,58.6 80.5,59 69.4,59 69.1,59.3 62.9,59.3 61.5,57.9 54.7,57.9 52.8,59.8 49.7,59.8 v48.9,59
  Bottom 0.254: v48.9,59 48.5,59 48.3,59.2 47.5,59.2 46.8,58.5 46.8,53.5 47.5,52.8 47.5,51.2 49,49.7 49,49.2 48.3,48.5 48.3,47.7 48.9,47.1 48.9,46 49.1,45.8 49.1,45.2 48.2,44.3 48.2,42.1 49.35,40.95 IC1.5
Z_MIN  (via drill 0.35)  (1 unrouted)
  Top 0.254: v18.6,52.2 D8.A | v23.4,52.2 C28.2 25.9,50.8 25.9,47.2 26.5,46.6 33.6,46.6 40.8,53.8 40.8,64.1 42.8,66.1 45.4,66.1 | IC1.18 44.79,56.19 45.7,57.1 45.7,60.9 46.3,61.5 46.3,65.2 45.4,66.1 | JP3.1 45.27,68.57 44.9,68.2 44.9,66.6 45.4,66.1
  Bottom 0.254: v18.6,52.2 v23.4,52.2
Z_MIN_HV
  Top 0.406: D8.C 7.8,52.2 6.8,53.2 6.8,79.8 5.29,81.31 ZMN.1
ZDIR  (via drill 0.35 pad 0.3)
  Top 0.254: PAD21.1 82,89.7 80.9,88.6 69.7,88.6 69.2,88.1 50.6,88.1 49.1,86.6 49.1,64.1 48.4,63.4 48.4,61.7 v48.2,61.5
  Bottom 0.254: v48.2,61.5 51.08,61.5 IC1.13
ZSTEP  (via drill 0.35 pad 0.3)
  Top 0.254: PAD23.1 92,89.6 91,88.6 81.6,88.6 81.1,88.1 69.9,88.1 69.4,87.6 50.9,87.6 49.6,86.3 49.6,63.9 48.9,63.2 48.9,61.3 48.4,60.8 47.9,60.8 46.7,59.6 46.7,56.7 46.2,56.2 46.2,55.4 45.9,55.1 45.9,52.2 47,51.1 v47,50.6 | IC1.6 49.6,45.2 49.6,45.7 48.4,46.9 47.4,46.9 v47.1,46.6
  Bottom 0.254: v47,50.6 46.8,50.4 46.8,46.9 v47.1,46.6

### Text on the board
Top: V2.1 | GRBL BASEBOARD | 2018 | Designed by | Peter van der Walt
tPlace: TOOL | 10U | GND/PWM/DIR | Z-MOTOR | A A B B | V2.1 | PWROUT | GND 24V | Z-END | VM/GND/SIG | 100K | M4 | ICSP | GND | RST | 0.1U | 10K | PROBE | SIG/GND/VM | SCK | MOSI | 5V | MISO | 18pF | A A B B | Y-MOTOR | RESET | 16M | M4 | 10K | 0.1U | 18pF | PROBE | Y-END | VM/GND/SIG | M4 | 10K | 0.1U | 104 | 1K | M4 | 10K | 0.1U | 10uF | COOLANT | 104 | 1K | 10K | TOOL ON | 220U | 220U | X-MOTOR | A A B B | M4 | MBRA210LT3 | 1K | XL1509 | MOTORS OFF | 10U | COOL | SPIND | 104 | 1K | AUTO / RST | POWER | RELAY | 1K | X-END | VM/GND/SIG | 104 | 2N2222 | +24v- | 1K | M4 | 100K | 22pF | CH340 | RELAY | SW/C/SW | 12M | 220U | 22pF | MBRA210LT3
bPlace: B- | B+ | A- | A+ | 24V | GND | GND | EN | GND | DIR | GND | STEP | B- | B+ | A- | A+ | 24V | GND | GND | EN | GND | DIR | GND | STEP | B- | B+ | A- | A+ | 24V | GND | GND | EN | GND | DIR | GND | STEP
tStop: GRBL BASEBOARD | 2018 | Designed by | Peter van der Walt